# Altium schematic sheet DAC.Schematic.SchDoc
size A
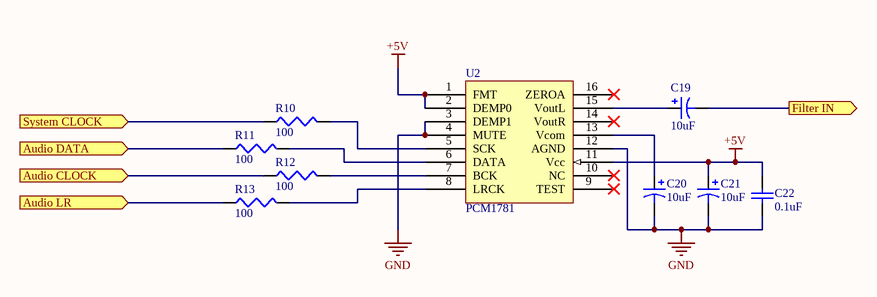
[diagram p0: DAC.Schematic.SchDoc]

## Parts
C19  10uF  [CAPC1608N - cap]
C20  10uF  [CAPC1608N - cap]
C21  10uF  [CAPC1608N - cap]
C22  0.1uF  [CAPC1608N - cap]
R10  100  [CAPC1608N]
R11  100  [CAPC1608N]
R12  100  [CAPC1608N]
R13  100  [CAPC1608N]
U2  PCM1781  [PCM1781]

## Ports
Audio CLOCK (in), Audio DATA (in), Audio LR (in), Filter IN (out), System CLOCK (in)

## Nets
+5V: C21.1 C22.2 U2.1(FMT) U2.2(DEMP0) U2.11(Vcc)
GND: C20.2 C21.2 C22.1 U2.3(DEMP1) U2.4(MUTE) U2.12(AGND)
Audio CLOCK: R12.1 ; port Audio CLOCK
Audio DATA: R11.1 ; port Audio DATA
Audio LR: R13.1 ; port Audio LR
Filter IN: C19.2 ; port Filter IN
System CLOCK: R10.1 ; port System CLOCK
NetC19_1: C19.1 U2.15(VoutL)
NetC20_1: C20.1 U2.13(Vcom)
NetR10_2: R10.2 U2.5(SCK)
NetR11_2: R11.2 U2.6(DATA)
NetR12_2: R12.2 U2.7(BCK)
NetR13_2: R13.2 U2.8(LRCK)

Not connected (* = marked no-connect by the designer): U2 9(TEST)* 10(NC)* 14(VoutR)* 16(ZEROA)*

## Library data of the parts
C19-C21 = Cap Pol1: Polarized Capacitor (Radial); Published: 8-Jun-2000; LatestRevisionDate: 17-Jul-2002; LatestRevisionNote: Re-released for DXP Platform.; PackageReference: RB7.6-15; Publisher: Altium Limited; PackageDescription: Polarized Capacitor (Radial); 2 Leads; Value: 10uF
C22 = Cap Semi: Capacitor (Semiconductor SIM Model); Value: 0.1u; Published: 8-Jun-2000; LatestRevisionDate: 29-May-2009; LatestRevisionNote: IPC-7351 Footprint Added.; PackageReference: C1206; Publisher: Altium Limited; PackageDescription: Chip Capacitor
R10-R13 = Res3: Resistor; Published: 8-Jun-2000; LatestRevisionDate: 29-May-2009; LatestRevisionNote: IPC-7351 Footprint Added.; PackageReference: J1-0603; Publisher: Altium Limited; PackageDescription: Chip Resistor; Value: 100
U2 = PCM1781 DAC: Fabricant: Texas Instruments; Ref_Fabricant: PCM1781DBQ; Ref_Farnell: 1697150; Datasheet: http://www.farnell.com/datasheets/1919085.pdf